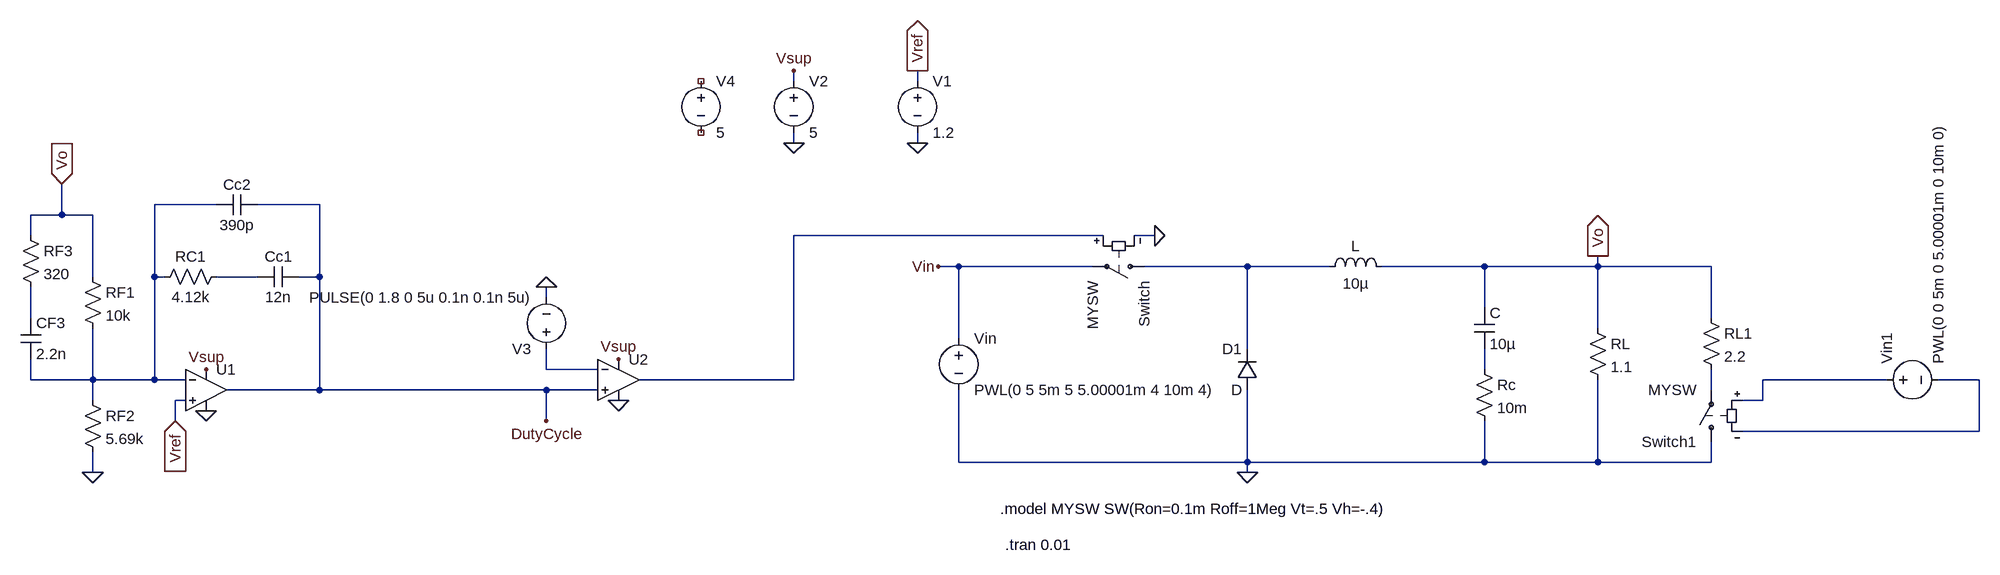
[diagram p0: schematic Buck_Controller_Modeling.asc]
Buck_Controller_Modeling.asc, the LTspice schematic file:
Version 4
SHEET 1 1524 772
WIRE -320 -256 -320 -272
WIRE -128 -256 -128 -272
WIRE -320 -160 -320 -176
WIRE -128 -160 -128 -176
WIRE -1216 -64 -1312 -64
WIRE -1056 -64 -1152 -64
WIRE -1456 -48 -1456 -96
WIRE -1456 -48 -1504 -48
WIRE -1408 -48 -1456 -48
WIRE -1504 -16 -1504 -48
WIRE 160 -16 -320 -16
WIRE 240 -16 208 -16
WIRE -64 32 -96 32
WIRE 144 32 -64 32
WIRE 384 32 224 32
WIRE 512 32 384 32
WIRE 752 32 592 32
WIRE 928 32 928 16
WIRE 928 32 752 32
WIRE 1104 32 928 32
WIRE -1408 48 -1408 -48
WIRE -1312 48 -1312 -64
WIRE -1296 48 -1312 48
WIRE -1152 48 -1216 48
WIRE -1056 48 -1056 -64
WIRE -1056 48 -1088 48
WIRE -704 80 -704 64
WIRE 752 96 752 32
WIRE -1504 112 -1504 64
WIRE 1104 112 1104 32
WIRE 928 128 928 32
WIRE -64 144 -64 32
WIRE 384 160 384 32
WIRE -704 192 -704 160
WIRE -624 192 -704 192
WIRE 752 192 752 160
WIRE -1504 208 -1504 176
WIRE -1408 208 -1408 128
WIRE -1408 208 -1504 208
WIRE -1312 208 -1312 48
WIRE -1312 208 -1408 208
WIRE -1264 208 -1312 208
WIRE -320 208 -320 -16
WIRE -320 208 -560 208
WIRE 1376 208 1184 208
WIRE 1520 208 1456 208
WIRE -1056 224 -1056 48
WIRE -1056 224 -1200 224
WIRE -704 224 -1056 224
WIRE -624 224 -704 224
WIRE 1104 224 1104 192
WIRE -1408 240 -1408 208
WIRE -1264 240 -1280 240
WIRE 1184 240 1184 208
WIRE 1184 240 1152 240
WIRE -1280 272 -1280 240
WIRE -704 272 -704 224
WIRE 1520 288 1520 208
WIRE 1520 288 1152 288
WIRE -64 336 -64 224
WIRE 384 336 384 224
WIRE 384 336 -64 336
WIRE 752 336 752 272
WIRE 752 336 384 336
WIRE 928 336 928 208
WIRE 928 336 752 336
WIRE 1104 336 1104 304
WIRE 1104 336 928 336
WIRE -1408 352 -1408 320
WIRE 384 352 384 336
FLAG 384 352 0
FLAG 928 16 Vo
IOPIN 928 16 Out
FLAG -128 -160 0
FLAG -128 -272 Vref
IOPIN -128 -272 Out
FLAG -1408 352 0
FLAG -1280 272 Vref
IOPIN -1280 272 In
FLAG -320 -160 0
FLAG -320 -272 Vsup
FLAG -1232 192 Vsup
FLAG -1232 256 0
FLAG -704 64 0
FLAG -592 176 Vsup
FLAG -592 240 0
FLAG 240 -16 0
FLAG -1456 -96 Vo
IOPIN -1456 -96 In
FLAG -704 272 DutyCycle
FLAG -96 32 Vin
SYMBOL voltage -64 128 R0
WINDOW 123 0 0 Left 0
WINDOW 39 0 0 Left 0
SYMATTR InstName Vin
SYMATTR Value PWL(0 5 5m 5 5.00001m 4 10m 4)
SYMBOL sw 240 32 R90
SYMATTR InstName Switch
SYMATTR Value MYSW
SYMBOL diode 400 224 R180
WINDOW 0 24 64 Left 2
WINDOW 3 24 0 Left 2
SYMATTR InstName D1
SYMBOL ind 496 48 R270
WINDOW 0 32 56 VTop 2
WINDOW 3 5 56 VBottom 2
SYMATTR InstName L
SYMATTR Value 10µ
SYMBOL cap 736 96 R0
SYMATTR InstName C
SYMATTR Value 10µ
SYMBOL res 736 176 R0
SYMATTR InstName Rc
SYMATTR Value 10m
SYMBOL res 912 112 R0
SYMATTR InstName RL
SYMATTR Value 1.1
SYMBOL Opamps\\UniversalOpamp2 -1232 224 R0
SYMATTR InstName U1
SYMBOL voltage -128 -272 R0
SYMATTR InstName V1
SYMATTR Value 1.2
SYMBOL res -1520 -32 R0
SYMATTR InstName RF3
SYMATTR Value 320
SYMBOL res -1424 32 R0
SYMATTR InstName RF1
SYMATTR Value 10k
SYMBOL cap -1520 112 R0
SYMATTR InstName CF3
SYMATTR Value 2.2n
SYMBOL res -1424 224 R0
SYMATTR InstName RF2
SYMATTR Value 5.69k
SYMBOL res -1200 32 R90
WINDOW 0 0 56 VBottom 2
WINDOW 3 32 56 VTop 2
SYMATTR InstName RC1
SYMATTR Value 4.12k
SYMBOL cap -1088 32 R90
WINDOW 0 0 32 VBottom 2
WINDOW 3 32 32 VTop 2
SYMATTR InstName Cc1
SYMATTR Value 12n
SYMBOL cap -1152 -80 R90
WINDOW 0 0 32 VBottom 2
WINDOW 3 32 32 VTop 2
SYMATTR InstName Cc2
SYMATTR Value 390p
SYMBOL voltage -320 -272 R0
WINDOW 123 0 0 Left 0
WINDOW 39 0 0 Left 0
SYMATTR InstName V2
SYMATTR Value 5
SYMBOL Opamps\\UniversalOpamp2 -592 208 R0
SYMATTR InstName U2
SYMBOL voltage -704 176 R180
WINDOW 123 0 0 Left 0
WINDOW 39 0 0 Left 0
SYMATTR InstName V3
SYMATTR Value PULSE(0 1.8 0 5u 0.1n 0.1n 5u)
SYMBOL sw 1104 320 R180
SYMATTR InstName Switch1
SYMATTR Value MYSW
SYMBOL res 1088 96 R0
SYMATTR InstName RL1
SYMATTR Value 2.2
SYMBOL voltage 1360 208 R270
WINDOW 123 0 0 Left 0
WINDOW 39 0 0 Left 0
SYMATTR InstName Vin1
SYMATTR Value PWL(0 0 5m 0 5.00001m 0 10m 0)
SYMBOL voltage -464 -272 R0
WINDOW 123 0 0 Left 0
WINDOW 39 0 0 Left 0
SYMATTR InstName V4
SYMATTR Value 5
TEXT 8 464 Left 2 !.tran 0.01
TEXT 0 408 Left 2 !.model MYSW SW(Ron=0.1m Roff=1Meg Vt=.5 Vh=-.4)

The netlist it stands for:
* Buck_Controller_Modeling.asc
Vin Vin 0 PWL(0 5 5m 5 5.00001m 4 10m 4)
Switch N003 Vin N002 0 MYSW
D1 0 N003 D
L N003 Vo 10µ
C Vo N007 10µ
Rc N007 0 10m
RL Vo 0 1.1
XU1 Vref N001 Vsup 0 DutyCycle level.2 Avol=1Meg GBW=10Meg Slew=10Meg ilimit=25m rail=0 Vos=0 phimargin=45 en=0 enk=0 in=0 ink=0 Rin=500Meg  ; pins IN+ IN- V+ V- OUT
V1 Vref 0 1.2
RF3 Vo N005 320
RF1 Vo N001 10k
CF3 N005 N001 2.2n
RF2 N001 0 5.69k
RC1 N004 N001 4.12k
Cc1 DutyCycle N004 12n
Cc2 DutyCycle N001 390p
V2 Vsup 0 5
XU2 DutyCycle N006 Vsup 0 N002 level.2 Avol=1Meg GBW=10Meg Slew=10Meg ilimit=25m rail=0 Vos=0 phimargin=45 en=0 enk=0 in=0 ink=0 Rin=500Meg  ; pins IN+ IN- V+ V- OUT
V3 N006 0 PULSE(0 1.8 0 5u 0.1n 0.1n 5u)
Switch1 0 N010 N008 N009 MYSW
RL1 Vo N010 2.2
Vin1 N008 N009 PWL(0 0 5m 0 5.00001m 0 10m 0)
V4 NC_01 NC_02 5
.model D D
.lib standard.dio
.tran 0.01
.model MYSW SW(Ron=0.1m Roff=1Meg Vt=.5 Vh=-.4)
.lib UniversalOpamps2.sub
.backanno
.end